# Altium project Pulse_Counter.PrjPcb
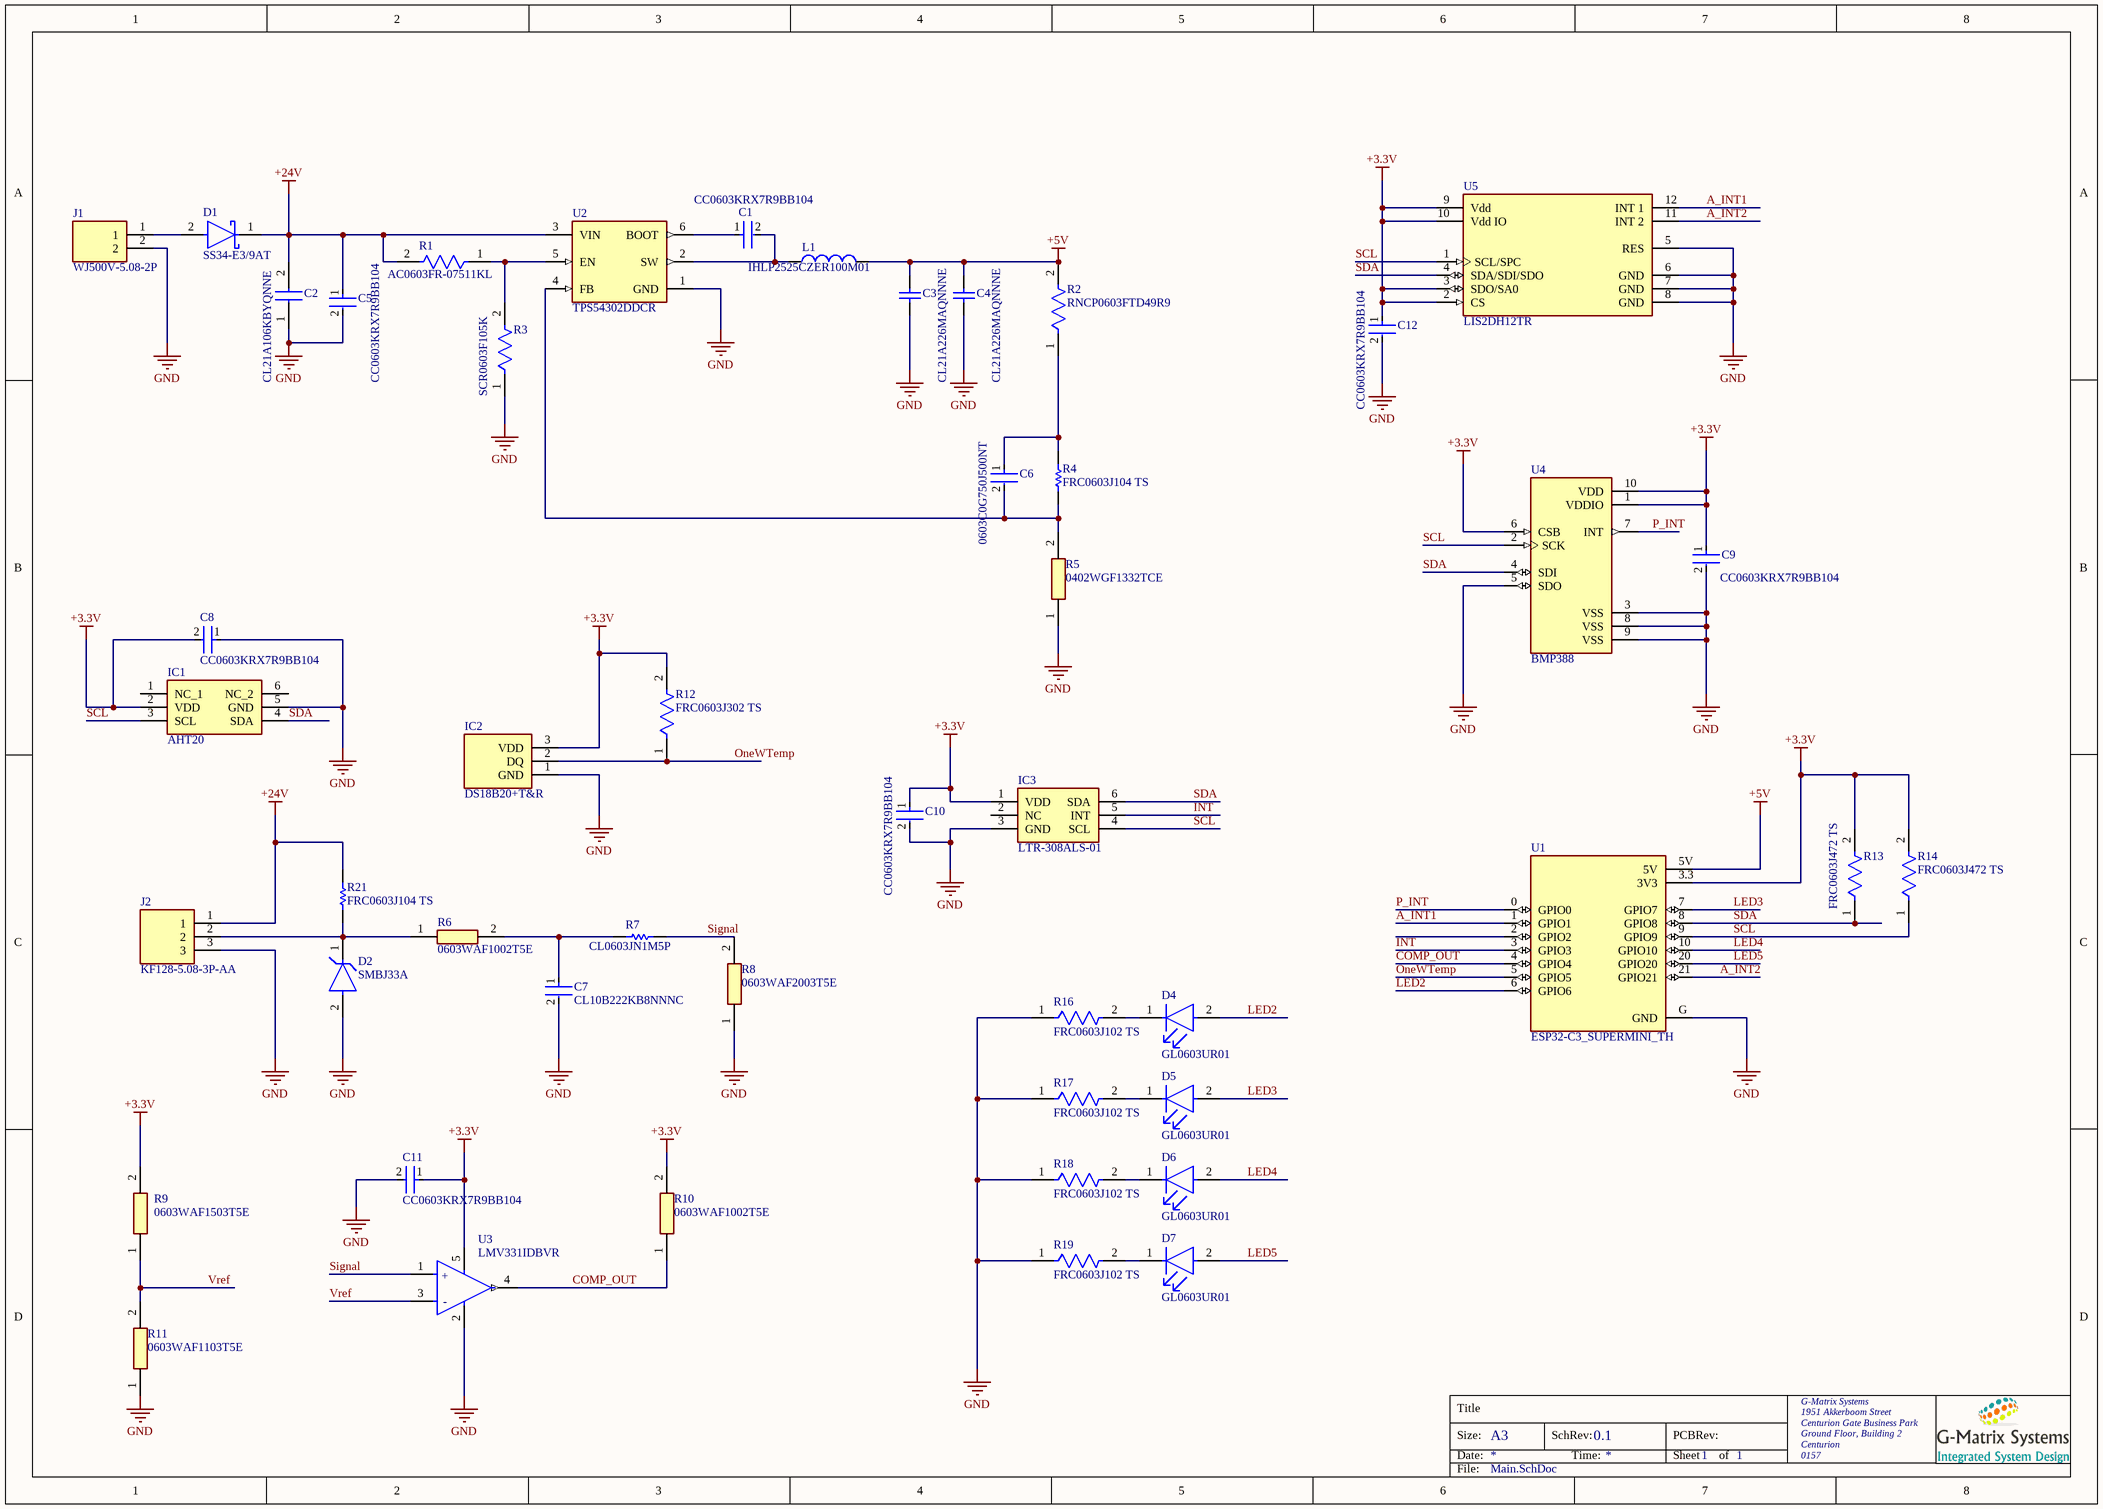
[diagram p0: Main.SchDoc]
1 sheet, 48 parts. Net scope: global (net labels, ports and power ports of the same name join across sheets).
Board file: PulseV1.PcbDoc

## Sheet Main.SchDoc
size A3; Organization: G-Matrix Systems; Address1: Centurion Gate Business Park; Address2: Ground Floor, Building 2; Address3: 1951 Akkerboom Street; Address4: Centurion; SheetNumber: 1; SheetTotal: 1; Address5: 0157; SchRevision: 0.1

### Parts
C1  CC0603KRX7R9BB104  [FP-CC0603-DA-MFG]
C2  CL21A106KBYQNNE  [CAPC2012X145N]
C3  CL21A226MAQNNNE  [CAPC2013X140X45LL15T25]
C4  CL21A226MAQNNNE  [CAPC2013X140X45LL15T25]
C5  CC0603KRX7R9BB104  [FP-CC0603-DA-MFG]
C6  0603C0G750J500NT  [FP-CC0603-0_1-0_9-MFG]
C7  CL10B222KB8NNNC  [FP-CL10-IPC_A]
C8  CC0603KRX7R9BB104  [FP-CC0603-DA-MFG]
C9  CC0603KRX7R9BB104  [FP-CC0603-DA-MFG]
C10  CC0603KRX7R9BB104  [FP-CC0603-DA-MFG]
C11  CC0603KRX7R9BB104  [FP-CC0603-DA-MFG]
C12  CC0603KRX7R9BB104  [FP-CC0603-DA-MFG]
D1  SS34-E3/9AT  [FP-SMC-MFG]
D2  SMBJ33A  [FP-SMBJ-MFG]
D4  GL0603UR01  [FP-LSM0603453V-MFG]
D5  GL0603UR01  [FP-LSM0603453V-MFG]
D6  GL0603UR01  [FP-LSM0603453V-MFG]
D7  GL0603UR01  [FP-LSM0603453V-MFG]
IC1  AHT20  [AHT20]
IC2  DS18B20+T&R  [DS18B20TR]
IC3  LTR-308ALS-01  [LTR303ALS01]
J1  WJ500V-5.08-2P  [WJ500V5082P]
J2  KF128-5.08-3P-AA  [KF1285083PAA]
L1  IHLP2525CZER100M01  [VISH-IHLP2525C-01_V]
R1  AC0603FR-07511KL  [FP-AC0603-MFG]
R2  RNCP0603FTD49R9  [FP-RNCP0603-IPC_C]
R3  SCR0603F105K  [FP-CPF0603-MFG]
R4  FRC0603J104 TS  [RESC0603(1608)_N]
R5  0402WGF1332TCE  [RESC1005X40N]
R6  0603WAF1002T5E  [RESC1608X55N]
R7  CL0603JN1M5P  [RESC0603(1608)_N]
R8  0603WAF2003T5E  [RESC1608X55N]
R9  0603WAF1503T5E  [RESC1608X55N]
R10  0603WAF1002T5E  [RESC1608X55N]
R11  0603WAF1103T5E  [RESC1608X55N]
R12  FRC0603J302 TS  [FP-ESR03-IPC_A]
R13  FRC0603J472 TS  [FP-MCT0603-IPC_C]
R14  FRC0603J472 TS  [FP-MCT0603-IPC_C]
R16  FRC0603J102 TS  [FP-TFCR0603-MFG]
R17  FRC0603J102 TS  [FP-TFCR0603-MFG]
R18  FRC0603J102 TS  [FP-TFCR0603-MFG]
R19  FRC0603J102 TS  [FP-TFCR0603-MFG]
R21  FRC0603J104 TS  [RESC0603(1608)_N]
U1  ESP32-C3_SUPERMINI_TH  [MODULE_ESP32-C3_SUPERMINI_TH]
U2  TPS54302DDCR  [FP-DDC0006A-MFG]
U3  LMV331IDBVR  [FP-DBV0005A-MFG]
U4  BMP388  [PQFN50P200X200X80-10N]
U5  LIS2DH12TR  [FP-LGA-12-8365767-MFG]

### Nets
+3.3V: C8.2 C9.1 C10.1 C11.1 C12.1 IC1.2(VDD) IC2.3(VDD) IC3.1(VDD) R9.2 R10.2 R12.2 R13.2 R14.2 U1.3.3(3V3) U3.5(VCC+) U4.1(VDDIO) U4.6(CSB) U4.10(VDD) U5.2(CS) U5.3(SDO/SA0) U5.9(Vdd) U5.10(Vdd_IO)
+5V: C3.2 C4.2 L1.2 R2.2 U1.5V
+24V: C2.2 C5.1 D1.1(C) J2.1 R1.2 R21.2 U2.3(VIN)
GND: C2.1 C3.1 C4.1 C5.2 C7.2 C8.1 C9.2 C10.2 C11.2 C12.2 D2.2(A) IC1.5(GND) IC2.1(GND) IC3.3(GND) J1.2 J2.3 R3.1 R5.1 R8.1 R11.1 R16.1 R17.1 R18.1 R19.1 U1.G(GND) U2.1(GND) U3.2(GND) U4.3(VSS) U4.5(SDO) U4.8(VSS) U4.9(VSS) U5.5(RES) U5.6(GND) U5.7(GND) U5.8(GND)
A_INT1: U1.1(GPIO1) U5.12(INT_1)
A_INT2: U1.21(GPIO21) U5.11(INT_2)
COMP_OUT: R10.1 U1.4(GPIO4) U3.4(OUT)
INT: IC3.5(INT) U1.3(GPIO3)
LED2: D4.2(A) U1.6(GPIO6)
LED3: D5.2(A) U1.7(GPIO7)
LED4: D6.2(A) U1.10(GPIO10)
LED5: D7.2(A) U1.20(GPIO20)
OneWTemp: IC2.2(DQ) R12.1 U1.5(GPIO5)
P_INT: U1.0(GPIO0) U4.7(INT)
SCL: IC1.3(SCL) IC3.4(SCL) R14.1 U1.9(GPIO9) U4.2(SCK) U5.1(SCL/SPC)
SDA: IC1.4(SDA) IC3.6(SDA) R13.1 U1.8(GPIO8) U4.4(SDI) U5.4(SDA/SDI/SDO)
Signal: R7.1 R8.2 U3.1(1IN+)
Vref: R9.1 R11.2 U3.3(1IN-)
NetC1_1: C1.1 U2.6(BOOT)
NetC1_2: C1.2 L1.1 U2.2(SW)
NetC6_1: C6.1 R2.1 R4.2
NetC6_2: C6.2 R4.1 R5.2 U2.4(FB)
NetC7_1: C7.1 R6.2 R7.2
NetD1_2: D1.2(A) J1.1
NetD2_1: D2.1(C) J2.2 R6.1 R21.1
NetD4_1: D4.1(C) R16.2
NetD5_1: D5.1(C) R17.2
NetD6_1: D6.1(C) R18.2
NetD7_1: D7.1(C) R19.2
NetR1_1: R1.1 R3.2 U2.5(EN)

Not connected (* = marked no-connect by the designer): IC1 1(NC_1) 6(NC_2); IC3 2(NC); U1 2(GPIO2)

### Notes on the sheet
- Title
- Size:
- Date:
- A3
- SchRev:
- Time:
- PCBRev:
- Sheet
- of
- File:
- (in symbol CMP-04896-000030-1) +; -

### Library data of the parts
C1 C5 C8-C12 = CMP-2100-03601-2: CAP CER 0.1UF 50V X7R 0603; Manufacturer: YAGEO; Material: Ceramic; Capacitance: 100 nF; Temperature Coefficient: 15%; Tolerance: 0.1; Value: 100 nF; Height: 0.9mm; Voltage: 50 V; ComponentLink2Description: Datasheet; Device Class L2: Capacitors; Temperature Range High: +125°C; Category: Cap; Footprint Url: http://www.yageo.com/exep/pages/download/literatures/UPY-C_GEN_24.pdf; ComponentLink2URL: http://www.yageo.com/documents/recent/UPY-GPHC_X7R_6.3V-to-50V_18.pdf; Package: CC0603-DA; Temperature: -55°C to +125°C; Voltage Rating: 50 V; Temperature Characteristic: X7R; Device Class L1: Passive Components; Temperature Range Low: -55°C; Manufacturer Part Number: CC0603KRX7R9BB104; RoHS: TRUE; Automotive: No; Device Class L3: Ceramic Capacitors; Octopart: https://octopart.com/cc0603krx7r9bb104-yageo-42244635; Mouser Description: Multilayer Ceramic Capacitor, CC Series, 0.1 - F, - 10%, X7R, 50 V, 0603 [1608 Metric]; Lead Free: Yes; Digikey Description: CAP CER 0.1UF 50V X7R 0603
C2 = CL21A106KBYQNNE: Capacitor; Manufacturer_Name: SAMSUNG; Height: 1.45mm; Manufacturer_Part_Number: CL21A106KBYQNNE; Mouser Part Number: 187-CL21A106KBYQNNE; Mouser Price/Stock: https://www.mouser.co.uk/ProductDetail/Samsung-Electro-Mechanics/CL21A106KBYQNNE?qs=xZ%2FP%252Ba9zWqbaYhx2cI%2FT%252BA%3D%3D; Arrow Part Number: CL21A106KBYQNNE; Arrow Price/Stock: https://www.arrow.com/en/products/cl21a106kbyqnne/samsung-electro-mechanics?region=nac
C3 C4 = CMP-2000-06104-1: Multi-layer Ceramic Capacitor, 22 uF, -55 to 85 degC, 2-Pin SMD (0805), RoHS, Tape and Reel; Manufacturer: Samsung Electro-Mechanics; Voltage - Rated: 25V; Other Names: 1276-2908-2; Capacitance: 22µF; Featured Product: Multi-LayerCeramicCapacitors; Product Training Modules: HighCapMLCCFamily; Temperature Coefficient: X5R; Tolerance: ±20%; Online Catalog: CLSeries,HighCapacitance; Applications: GeneralPurpose; RoHS Information: MLCCRoHS2Compliance; Height - Seated (Max): -; Lead Style: -; Lead Spacing: -; Datasheet URL: http://datasheet.octopart.com/CL21A226MAQNNNE-Samsung-datasheet-48647558.pdf; Size / Dimension: 0.079"Lx0.049"W(2.00mmx1.25mm); Thickness (Max): 0.055"(1.40mm); Family: CeramicCapacitors; Package Description: 2-Pin Surface Mount Device, Body 2.0 x 1.25 mm; Datasheet Version: 07/2015; Packaging: Tape&Reel(TR); Manufacturer URL: http://www.samsungsem.com/global/index.jsp; Ratings: -; Package / Case: 0805(2012Metric); Standard Package: 2,000; Mounting Type: SurfaceMount,MLCC; Mounting Technology: SurfaceMount; Category: Capacitors; Package Reference: 0805; Series: CL; Features: -; Operating Temperature: -55°C~85°C
C6 = CMP-00621-71334419-1: CC0603FRNPO9BN750 Multilayer Ceramic Capacitor, 75 pF, 50 V, ± 1%, C0G (NP0), 0603 [1608 Metric]; Temperature Coefficient: 30ppm/°C; Voltage Rating: 50V; Capacitance: 75pF; Thickness: 889µm; NexarPartId: 71334419; Case Code (Imperial): 0603; Case/Package: 0603; Min Operating Temperature: -55°C; Height: 900µm; Tolerance: 1%; Width: 787.4µm; Dielectric: C0G; Termination: SMD/SMT; Max Operating Temperature: 125°C; Voltage Rating (DC): 50V; Composition: Ceramic; Material: Ceramic; Length: 1.6002mm; Lead Free: Lead Free; Weight: 2.012816mg; Case Code (Metric): 1608; Halogen Free: Halogen Free; RoHS: Compliant; Mount: Surface Mount
C7 = CMP-13271-002956-1: Cap Ceramic 2.2nF 50V X7R ±10% Pad SMD 0603 +125°C T/R; Voltage: 25V; Voltage Rating (DC): 50V; Material: Ceramic; Length: 1.6mm; Depth: 0.8mm; Case Code (Imperial): 0603; Packaging: Tape and Reel; Lead Free: Lead Free; Radiation Hardening: No; Width: 0.031inch; Capacitance: 2.2nF; Package Quantity: 1; Thickness: 0.035inch; Contact Plating: Tin; Dielectric: X7R; Voltage Rating: 50V; Tolerance: 10%; Max Operating Temperature: 125°C; Min Operating Temperature: -55°C; Case/Package: 0603; Height: 0.8mm; Case Code (Metric): 1608; Mount: Surface Mount
D1 = CMP-02539-000066-1: DIODE SCHOTTKY 40V 3A DO214AB; Peak Non-Repetitive Surge Current: 100A; Forward Voltage: 500mV; Element Configuration: Single; Max Reverse Current: 500uA; Case/Package: SMC; Radiation Hardening: No; Series: -; Max Surge Current: 100A; RoHS Compliant: Yes; Min Operating Temperature: -55°C; Average Rectified Current: 3A; Max Reverse Leakage Current: 500uA; Package Quantity: 3500; Max Reverse Voltage (DC): 40V; Forward Current: 3A; Packaging: Tape and Reel; Max Operating Temperature: 125°C; Max Repetitive Reverse Voltage (Vrrm): 40V; Number of Pins: 2; Mount: Surface Mount
D2 = CMP-2000-07095-2: TVS DIODE 33V 53.3V DO214AA; Manufacturer: Littelfuse Inc; Max Junction Temp: +150°C; Number Of Channels: 1; Breakdown Voltage: 36.7V; Peak Pulse Power: 600W; Direction: Unidirectional; Peak Pulse Current: 11.3A; Lead Free: Yes; Height: 2.61mm; Temperature Range Low: -65°C; ComponentLink2URL: https://www.littelfuse.com/~/media/electronics/datasheets/tvs_diodes/littelfuse_tvs_diode_smbj_datasheet.pdf.pdf; Manufacturer Part Number: SMBJ33A; Clamping Voltage: 53.3V; Device Class L1: Circuit Protection; Octopart: https://octopart.com/smbj33a-littelfuse-350829; Device Class L2: TVS Diodes; Digikey Description: TVS DIODE 33V 53.3V DO214AA; Automotive: No; Temperature Range High: +150°C; Package: SMBJ; ComponentLink2Description: Datasheet; Mouser Description: TVS DIODE 33V 53.3V DO214AA; Reverse Standoff Voltage: 33V; Category: Diode; Device Class L3: unset; Temperature: -65°C to +150°C; RoHS: TRUE
D4-D7 = CMP-00731-94024739-1: LSM0603453V LED SM 0603 3V -/1000/-mcd Green; Forward Current: 20mA; Forward Voltage: 2.3V; Viewing Angle: 120°; Reverse Voltage: 5V; Power Dissipation: 60mW; Wavelength: 576nm; Luminous Intensity: 120mcd; NexarPartId: 94024739; Height: 550µm; Max Operating Temperature: 85°C; Schedule B: 8541402000, 8541406050; Case/Package: 0603; Color: Green; Min Operating Temperature: -40°C
IC1 = AHT20: Integrated Circuit; Manufacturer_Name: Adafruit; Datasheet Link: https://cdn-learn.adafruit.com/assets/assets/000/091/676/original/AHT20-datasheet-2020-4-16.pdf?1591047915; Height: 1.1mm; Manufacturer_Part_Number: AHT20
IC2 = DS18B20+T&R: Integrated Circuit; Manufacturer_Name: Analog Devices; Datasheet Link: https://www.analog.com/en/products/ds18b20.html#product-overview; Height: 4.95mm; Manufacturer_Part_Number: DS18B20+T&R; Mouser Part Number: 700-DS18B20T&R; Mouser Price/Stock: https://www.mouser.co.uk/ProductDetail/Analog-Devices-Maxim-Integrated/DS18B20%2bTR?qs=7H2Jq%252ByxpJKpIDCbiq4lfg%3D%3D; Arrow Part Number: DS18B20+T&R; Arrow Price/Stock: https://www.arrow.com/en/products/ds18b20tr/analog-devices?utm_currency=USD&region=nac
IC3 = LTR-308ALS-01: Integrated Circuit; Manufacturer_Name: Lite-On; Datasheet Link: https://optoelectronics.liteon.com/upload/download/DS86-2016-0027/LTR-308ALS_Final_%20DS_V1%201.pdf; Height: 0mm; Manufacturer_Part_Number: LTR-308ALS-01; Mouser Part Number: N/A; Mouser Price/Stock: https://www.mouser.com/Search/Refine.aspx?Keyword=N%2FA; Arrow Part Number: LTR-308ALS-01; Arrow Price/Stock: https://www.arrow.com/en/products/ltr-308als-01/lite-on-technology?utm_currency=USD&region=europe
J1 = WJ500V-5.08-2P: Connector; Manufacturer_Name: Ningbo Kangnex; Datasheet Link: https://datasheet.lcsc.com/szlcsc/1912251636_Ningbo-Kangnex-Elec-WJ500V-5-08-2P_C8465.pdf; Height: 14.2mm; Manufacturer_Part_Number: WJ500V-5.08-2P
J2 = KF128-5.08-3P-AA: Connector; Manufacturer_Name: CIXI KEFA ELECTRONICS; Datasheet Link: https://datasheet.lcsc.com/lcsc/2001152335_Cixi-Kefa-Elec-KF128-5-08-3P-AA_C474953.pdf; Height: 14.1mm; Manufacturer_Part_Number: KF128-5.08-3P-AA
L1 = CMP-2000-06440-1: Low-Profile, High Current IHLP(R) Inductor, 10 uH, 5 MHz, -55 to 125 degC, 2-Pin SMD, RoHS, Tape and Reel; Manufacturer: Vishay; Maximum DC Resistance: 105mOhms; Brand: Vishay/Dale; Type: LowProfileHighCurrentIHLPInductors; Case Width: 6.47mm; Test Frequency: 100kHz; Shielding: Shielded; Self Resonant Frequency: 5MHz; Tolerance: 20%; Case Length: 6.86mm; Case Height: 3mm; Maximum DC Current: 3A; Inductance: 10uH; Mounting Technology: SurfaceMount; Product: PowerInductors; Operating Temperature Range: -55Cto+125C; Series: IHLP-2525CZ-01; Package / Case: 2525(6363metric); Termination Style: SMD/SMT; Package Reference: IHLP2525C-01; RoHS: Details; Datasheet Version: 02/2015; Package Description: 2-Pin Surface Mount Device; Manufacturer URL: http://www.vishay.com/; Product Category: FixedInductors; Packaging: Reel; Datasheet URL: http://download.siliconexpert.com/pdfs/2016/3/15/16/5/35/891/vsh_/manual/812046841784326lp25cz01.pdf
R1 = CMP-03412-025197-2: RES 511KΩ 1.00% 0.1W 0603; Tolerance: 1%; Voltage Rating: 50V; Resistance: 511kR; Power Rating: 100mW; Temperature Coefficient: 100ppm/°C; Length: 0.063inch; Packaging: Tape and Reel; Series: AC; Height: 0.022inch; Case/Package: 0603; Width: 0.8mm; Max Power Dissipation: 100mW; Resistor Type: Thick Film; Case Code (Metric): 1608; Weight: 7.1E-05oz; Min Operating Temperature: -55°C; Case Code (Imperial): 0603; Max Operating Temperature: 155°C; Features: Moisture Resistant; RoHS Compliant: Yes; Termination: SMD/SMT; Number of Terminations: 2
R2 = CMP-26527-005229-1: 49.9Ω ±1% 0.125W 0603 High Power Anti-Sulfur Thin Film Chip Resistor; Temperature Coefficient: 100ppm/°C; Resistance: 49.9R; Max Power Dissipation: 125mW; Max Operating Temperature: 155°C; Resistor Type: Thin Film; Case Code (Metric): 1608; Case/Package: 0603; Tolerance: 1%; Length: 0.059inch; Mount: Surface Mount; Case Code (Imperial): 0603; Features: Moisture Resistant; Series: RNCP; Height: 0.02inch; Min Operating Temperature: -55°C; Number of Terminations: 2; Packaging: Cut Tape; Width: 0.031inch; Lead Free: Lead Free; RoHS Compliant: Yes
R3 = CMP-03211-005275-1: RES SMD 105KΩ 1% 1/16W 0603; Manufacturer Part Number: CPF0603F105KC1; Manufacturer: TE Connectivity; Voltage Rating: 50V; Temperature Coefficient: 50ppm/°C; Power Rating: 0.063W; Tolerance: 1%; Lead Free: Yes; Temperature Range Low: -55°C; Category: Res; Octopart: https://octopart.com/cpf0603f105kc1-te+connectivity-7514804; Ipc Land Pattern Name: RESC15580X45; Temperature Range High: +155°C; Device Class L2: Resistors; Resistance: 105KΩ; Temperature: -55°C to +155°C; octopart_url: https://octopart.com/cpf0603f105kc1-te+connectivity-7514804; Height: 0.55mm; RoHS: TRUE; Device Class L1: Passive Components; Value: 105KΩ; ComponentLink2URL: https://www.te.com/commerce/DocumentDelivery/DDEController?Action=showdoc&DocId=Data+Sheet%7F1773200%7FM%7Fpdf%7FEnglish%7FENG_DS_1773200_M.pdf%7F3-1676481-2; packaging: 1k Reel; Device Class L3: Chip SMD Resistors; Package: CPF0603; ComponentLink2Description: Datasheet; Automotive: No; Series: CPF; Composition: Thin Film
R4 R21 = CMP-1012-00736-1: 100K 0.1W 1% 0603 (1608 Metric)  SMD; Value: 100000.00 Ohm; Case-Metric: 1608; Case-EIA: 0603; Power: 0.1 W; Tolerance: 1 %; Technology: SMT
R5 = 0402WGF1332TCE: Resistor; Manufacturer_Name: UNI-ROYAL(Uniroyal Elec); Datasheet Link: https://datasheet.lcsc.com/lcsc/2205312316_UNI-ROYAL-Uniroyal-Elec-0402WGF1332TCE_C122547.pdf; Height: 0.4mm; Manufacturer_Part_Number: 0402WGF1332TCE
R6 R10 = 0603WAF1002T5E: Resistor; Manufacturer_Name: ROYALOHM; Datasheet Link: https://th.mouser.com/datasheet/2/1365/1-3044649.pdf; Height: 0.55mm; Manufacturer_Part_Number: 0603WAF1002T5E; Mouser Part Number: 303-0603WAF1002T5E; Mouser Price/Stock: https://www.mouser.co.uk/ProductDetail/Royalohm/0603WAF1002T5E?qs=e8oIoAS2J1TC2D0IjbSyGA%3D%3D
R7 = CMP-1012-00150-1: 1M5 0.1W 5% 0603 (1608 Metric)  SMD; Value: 1500000.00 Ohm; Case-Metric: 1608; Case-EIA: 0603; Technology: SMT; Tolerance: 5 %; Power: 0.1 W
R8 = 0603WAF2003T5E: Resistor; Manufacturer_Name: UNI-ROYAL(Uniroyal Elec); Datasheet Link: https://datasheet.lcsc.com/szlcsc/Uniroyal-Elec-0603WAF2003T5E_C25811.pdf; Height: 0.55mm; Manufacturer_Part_Number: 0603WAF2003T5E
R9 = 0603WAF1503T5E: Resistor; Manufacturer_Name: UniOhm; Datasheet Link: https://4donline.ihs.com/images/VipMasterIC/IC/UNOD/UNODS00002/UNODS00002-1.pdf?hkey=EF798316E3902B6ED9A73243A3159BB0; Height: 0.55mm; Manufacturer_Part_Number: 0603WAF1503T5E
R11 = 0603WAF1103T5E: Resistor; Manufacturer_Name: UNI-ROYAL(Uniroyal Elec); Datasheet Link: https://datasheet.lcsc.com/szlcsc/Uniroyal-Elec-0603WAF1103T5E_C25805.pdf; Height: 0.55mm; Manufacturer_Part_Number: 0603WAF1103T5E
R12 = CMP-08839-028498-1: 3kΩ ±5% 0.25W 0603 Anti-Surge Chip Resistor AEC-Q200; Resistance: 3kR; Temperature Coefficient: 200ppm/°C; Max Power Dissipation: 250mW; Package Quantity: 5000; Case/Package: 0603; Number of Terminations: 2; RoHS Compliant: Yes; Height: 0.022inch; Packaging: Tape and Reel; Min Operating Temperature: -55°C; Max Operating Temperature: 155°C; Series: ESR; Case Code (Metric): 1608; Features: Automotive AEC-Q200; Width: 0.031inch; Case Code (Imperial): 0603; Length: 0.063inch; Resistor Type: Thick Film; Tolerance: 5%
R13 R14 = CMP-02407-001874-1: RES SMD 100 OHM 1% 1/8W 0603
R16-R19 = CMP-250906-155217-1: RES Thin Film,  1kΩ, 1%, 0.1W, 25ppm/°C, 0603
U1 = ESP32-C3_SUPERMINI_TH: Super tiny ESP32-C3 board; MF: Espressif Systems; MP: ESP32-C3 SuperMini_TH; SnapEDA_Link: https://www.snapeda.com/parts/ESP32-C3%20SuperMini_TH/Espressif+Systems/view-part/?ref=snap; Package: Package; Value: *; Check_prices: https://www.snapeda.com/parts/ESP32-C3%20SuperMini_TH/Espressif+Systems/view-part/?ref=eda
U2 = CMP-04918-000032-1: IC REG BUCK ADJ 3A TSOT23-6; Manufacturer: Texas Instruments; Output Voltage: 0.6-26V; Output Type: AdjustableProgrammable; Max Junction Temp: +125°C; Number Of Outputs: 1; Min Supply Voltage: 4.5V; Switching Frequency: 400kHz; Standoff Height: 0mm; Max Duty Cycle: 100%; Nominal Supply Current: 45uA; Max Supply Voltage: 28V; Temperature Range High: +125°C; Switching Topology: Buck; Device Class L2: Power Management ICs; Output Current: 3A; Automotive: No; Temperature Range Low: -40°C; Temperature: -40°C to +125°C; Height: 1.1mm; Ipc Land Pattern Name: SOT95P280X110-6; RoHS: TRUE; Digikey Description: IC REG BUCK ADJ 3A TSOT23-6; Manufacturer Part Number: TPS54302DDCR; ComponentLink2Description: Datasheet; Device Class L3: Voltage Regulators - Switching; Octopart: https://octopart.com/tps54302ddcr-texas+instruments-74209025; Device Class L1: Integrated Circuits (ICs); Lead Free: Yes; ComponentLink2URL: http://www.ti.com/lit/ds/symlink/tps54302.pdf; Category: IC; Package: DDC0006A
U3 = CMP-04896-000030-1: IC GP LV COMPARATOR SOT-23-5; Manufacturer: Texas Instruments; Max Junction Temp: +150°C; Nominal Supply Current: 40-60uA; Max Supply Voltage: 5.5V; Input Offset Voltage: 1.7mV; Voltage Gain: 50V/mV; Number Of Channels: 1; Output Current Per Channel: 23-84mA; Input Bias Current: 0.015uA; Min Supply Voltage: 2.7V; Standoff Height: 0mm; ComponentLink2URL: http://www.ti.com/lit/ds/symlink/lmv331.pdf; Digikey Description: IC GP LV COMPARATOR SOT-23-5; Device Class L2: Linear ICs; Manufacturer Part Number: LMV331IDBVR; Mouser Description: Analog Comparators Single GP LV; Category: IC; Ipc Land Pattern Name: SOT95P280X145-5; ComponentLink2Description: Datasheet; RoHS: TRUE; Temperature Range High: +125°C; Temperature Range Low: -40°C; Automotive: No; Ambient Temperature Range High: +125°C; Device Class L1: Integrated Circuits (ICs); Package: DBV0005A; Ambient Temperature Range Low: -40°C; Octopart: https://octopart.com/lmv331idbvr-texas+instruments-428444; Height: 1.45mm; Device Class L3: Comparators; Lead Free: Yes; Temperature: -40°C to +125°C
U4 = CMP-038-000000-1: P-Sensor SPI I2C 1, 25 Bar SMD; Source: BMP388.SchLib; Component Type: Standard; Pin Count: 10; Value: *; Package: None; MP: BMP388; Price: None; Availability: Unavailable; Design Item ID: BMP388
U5 = CMP-2000-05369-2: ACCEL 2-16G I2C/SPI 12LGA; Output Type: SPI; Axis: X, Y, Z; Interface: I2C; Max Supply Voltage: 3.6V; Bandwidth: 672Hz; Min Supply Voltage: 1.71V; Min Operating Temperature: -40°C; Width: 2.15mm; Lead Free: Lead Free; Case/Package: LGA; Contact Plating: Gold; Number of Pins: 12; Max Operating Temperature: 85°C; Packaging: Cut Tape; Radiation Hardening: No; Length: 2.15mm; REACH SVHC: No SVHC; Height: 1mm; Mount: Surface Mount